# EAGLE schematic BMS_master_board (EAGLE 6.5.0)
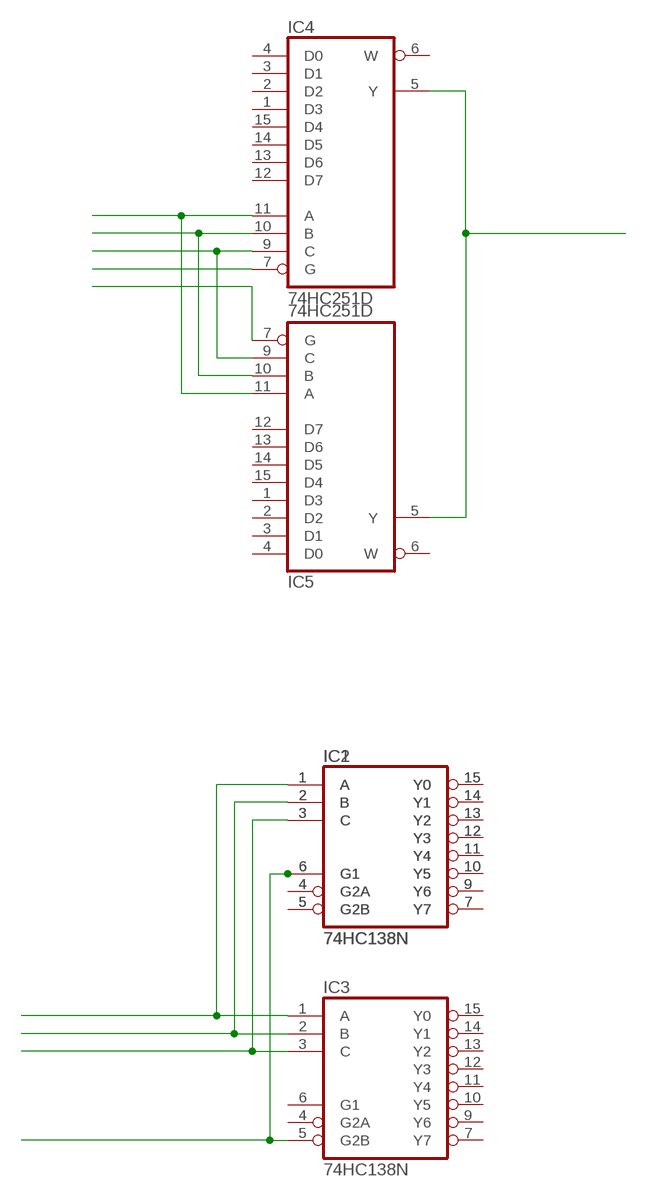
[diagram p0: schematic, sheet 1]

## Parts
IC1  74HC138N  [DIL16]
IC2  74HC138N  [DIL16]
IC3  74HC138N  [DIL16]
IC4  74HC251D  [SO16]
IC5  74HC251D  [SO16]

## Nets
N$1: IC1.1(A) IC2.1(A) IC3.1(A)
N$2: IC1.2(B) IC2.2(B) IC3.2(B)
N$3: IC1.3(C) IC2.3(C) IC3.3(C)
N$4: IC1.4(G2A) IC2.4(G2A)
N$5: IC1.6(G1) IC2.6(G1) IC3.5(G2B)
N$6: IC4.5(Y) IC5.5(Y)
N$7: IC1.7(Y7) IC2.7(Y7)
N$8: IC1.9(Y6) IC2.9(Y6)
N$9: IC1.10(Y5) IC2.10(Y5)
N$10: IC1.11(Y4) IC2.11(Y4)
N$11: IC1.12(Y3) IC2.12(Y3)
N$12: IC1.13(Y2) IC2.13(Y2)
N$13: IC1.14(Y1) IC2.14(Y1)
N$14: IC1.15(Y0) IC2.15(Y0)
N$15: IC1.5(G2B) IC2.5(G2B)
N$16: IC4.9(C) IC5.9(C)
N$17: IC4.10(B) IC5.10(B)
N$18: IC4.11(A) IC5.11(A)
N$19: IC4.7(G)
N$20: IC5.7(G)
Unconnected: IC3.4(G2A) IC3.6(G1) IC3.7(Y7) IC3.9(Y6) IC3.10(Y5) IC3.11(Y4) IC3.12(Y3) IC3.13(Y2) IC3.14(Y1) IC3.15(Y0) IC4.1(D3) IC4.2(D2) IC4.3(D1) IC4.4(D0) IC4.6(W) IC4.12(D7) IC4.13(D6) IC4.14(D5) IC4.15(D4) IC5.1(D3) IC5.2(D2) IC5.3(D1) IC5.4(D0) IC5.6(W) IC5.12(D7) IC5.13(D6) IC5.14(D5) IC5.15(D4)

## Power pins joined to a net without a drawn wire
GND: IC1.8(GND) IC2.8(GND) IC3.8(GND) IC4.8(GND) IC5.8(GND)
VCC: IC1.16(VCC) IC2.16(VCC) IC3.16(VCC) IC4.16(VCC) IC5.16(VCC)

## Library data of the parts
IC1-IC3 = 74xx-eu:74*138: 3-line to 8-line DECODER/DEMULTIPLEXER
IC4 IC5 = 74xx-eu:74*251: 1 of 8 data SELECTOR/MULTIPLEXER, 3-state